# Altium schematic sheet USB-UART.SchDoc
size A
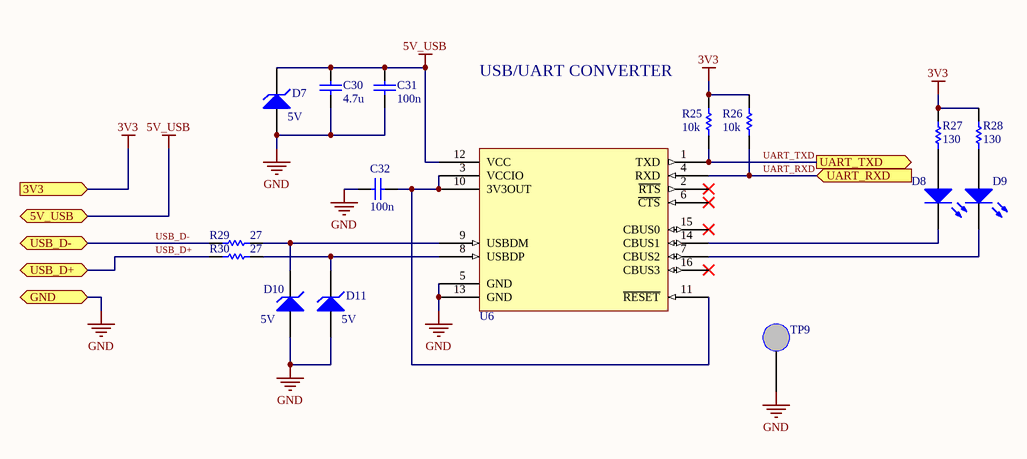
[diagram p0: USB-UART.SchDoc]

## Parts
C30  value 4.7u  [CS-0603]  (hidden comment: CS - CAPACITOR)
C31  value 100n  [CS-0603]  (hidden comment: CS - CAPACITOR)
C32  value 100n  [CS-0603]  (hidden comment: CS - CAPACITOR)
D7  Voltage - Reverse Standoff (Typ): 5V  [DS-SOD523]  (hidden comment: DS - TVS ESD5Z5.0T1G)
D8  LED - NORMAL LED  [LED-0603 GREEN]  (value not drawn)
D9  LED - NORMAL LED  [LED-0603 GREEN]  (value not drawn)
D10  Voltage - Reverse Standoff (Typ): 5V  [DS-SOD523]  (hidden comment: DS - TVS ESD5Z5.0T1G)
D11  Voltage - Reverse Standoff (Typ): 5V  [DS-SOD523]  (hidden comment: DS - TVS ESD5Z5.0T1G)
R25  value 10k  [RS-0603]  (hidden comment: RS - RESISTOR)
R26  value 10k  [RS-0603]  (hidden comment: RS - RESISTOR)
R27  value 130  [RS-0603]  (hidden comment: RS - RESISTOR)
R28  value 130  [RS-0603]  (hidden comment: RS - RESISTOR)
R29  value 27  [RS-0603]  (hidden comment: RS - RESISTOR)
R30  value 27  [RS-0603]  (hidden comment: RS - RESISTOR)
TP9  5003K  [TP - VERTICAL]  (value not drawn)
U6  IC - FT230XS  [IC-SSOP-16]  (value not drawn)

## Ports
3V3 (in), 5V_USB, GND, UART_RXD (in), UART_TXD (out), USB_D+ (bidir), USB_D- (bidir)

## Nets
3V3: R25.2 R26.2 R27.2 R28.2 ; port 3V3
5V_USB: C30.2 C31.2 D7.K U6.12(VCC) ; port 5V_USB
GND: C30.1 C31.1 C32.2 D7.A D10.A D11.A TP9.1 U6.5(GND) U6.13(GND) ; port GND
UART_RXD: R26.1 U6.4(RXD) ; port UART_RXD
UART_TXD: R25.1 U6.1(TXD) ; port UART_TXD
USB_D+: R30.2 ; port USB_D+
USB_D-: R29.2 ; port USB_D-
NetC32_1: C32.1 U6.3(VCCIO) U6.10(3V3OUT) U6.11(~{RESET})
NetD8_A: D8.A R27.1
NetD8_K: D8.K U6.14(CBUS1)
NetD9_A: D9.A R28.1
NetD9_K: D9.K U6.7(CBUS2)
NetD10_K: D10.K R29.1 U6.9(USBDM)
NetD11_K: D11.K R30.1 U6.8(USBDP)

Not connected (* = marked no-connect by the designer): U6 2(~{RTS})* 6(~{CTS})* 15(CBUS0)* 16(CBUS3)*

## Notes on the sheet
- USB/UART CONVERTER

## Library data of the parts
C30-C32 = CS - CAPACITOR: TOLERANCE: 10%; VOLTAGE: 16V; Supplier 1: *; (FIELD A): *; (FLIED C): *; (FIELD B): *; Manufacturer: *
  C30: Supplier Part Number 1: *
  C31 C32: Supplier Part Number 1: 490-1532-1-ND
D7 D10 D11 = DS - TVS ESD5Z5.0T1G: TVS 5V; Manufacturer: ON Semiconductor; Supplier Part Number 1: *; Supplier 1: *; FORWARS VOLTAGE: *; (FIELD A): *; (FIELD B): *; Supplier 2: Digi-Key; Supplier Part Number 2: ESD5Z5.0T1GOSCT-ND
R25-R30 = RS - RESISTOR: TOLERANCE: RES TOL; POWER: RES POWER; Supplier Part Number 1: *; Supplier 1: *; (FIELD A): *; (FLIED C): *; (FIELD B): *; Manufacturer: *
TP9 = TP - Test point vertical: (FIELD A): *; (FIELD B): *; (FIELD C): *; Manufacturer: *; Supplier 1: Newark; Supplier Part Number 1: 62W5140
U6 = IC - FT230XS: USB to BASIC UART IC; Manufacturer: FTDI; Supplier 1: Digi-Key; Supplier Part Number 1: 768-1154-5-ND; (FIELD A): *; (FIELD B): *; (FIELD C): *
D8 D9 = LED - NORMAL LED: FORWARS VOLTAGE: *; CURRENT: *; COLOR: *; Supplier Part Number 1: *; Supplier 1: *; (FIELD B): *; (FIELD A): *; (FIELD C): *; Manufacturer: *